# Altium schematic sheet motor0.SchDoc
size A4; SheetNumber: 2; SheetTotal: 4
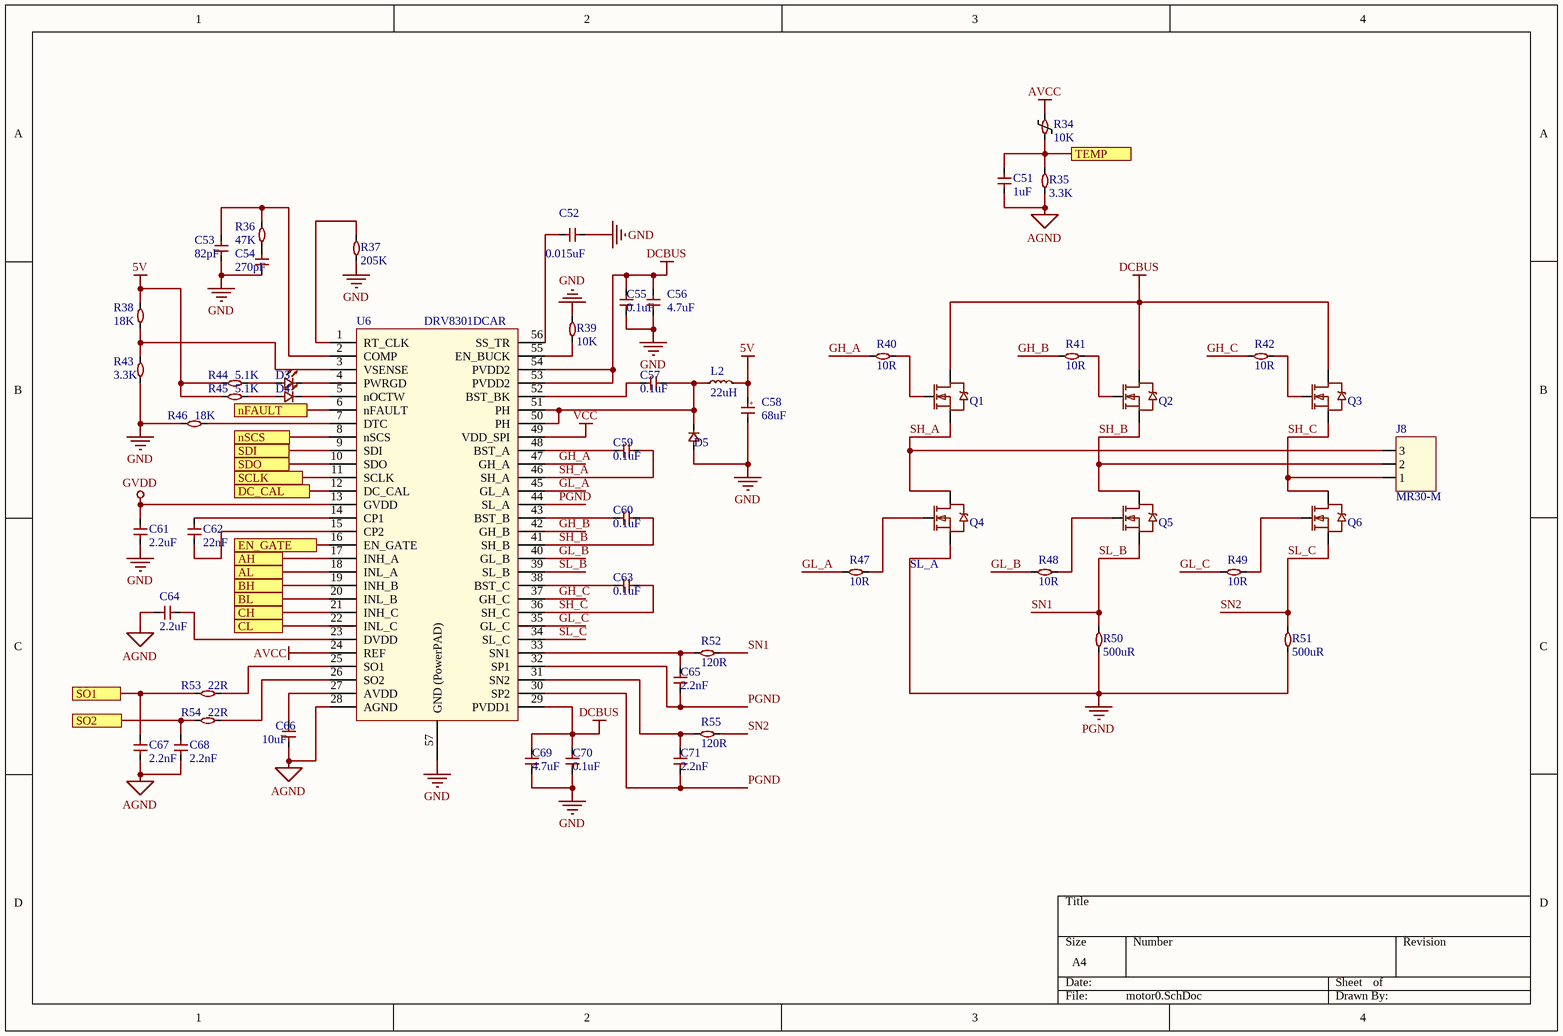
[diagram p0: motor0.SchDoc]

## Parts
C51  1uF  [C0402]
C52  0.015uF  [C0402]
C53  82pF  [C0402]
C54  270pF  [C0402]
C55  0.1uF  [C0402]
C56  4.7uF  [C0402]
C57  0.1uF  [C0402]
C58  68uF  [C1206]
C59  0.1uF  [C0402]
C60  0.1uF  [C0402]
C61  2.2uF  [C0402]
C62  22nF  [C0402]
C63  0.1uF  [C0402]
C64  2.2uF  [C0402]
C65  2.2nF  [C0402]
C66  10uF  [C0402]
C67  2.2nF  [C0402]
C68  2.2nF  [C0402]
C69  4.7uF  [C0402]
C70  0.1uF  [C0402]
C71  2.2nF  [C0402]
D3  LED  [LED-0402]  (value not drawn)
D4  LED  [LED-0402]  (value not drawn)
D5  MBR0540  [SOD-323]  (value not drawn)
J8  MR30-M  [AMASS-MR30-M]
L2  22uH  [L1008]
Q1  AP68N06G  [TDSON-8_L5.0-W6.0-3PIN]  (value not drawn)
Q2  AP68N06G  [TDSON-8_L5.0-W6.0-3PIN]  (value not drawn)
Q3  AP68N06G  [TDSON-8_L5.0-W6.0-3PIN]  (value not drawn)
Q4  AP68N06G  [TDSON-8_L5.0-W6.0-3PIN]  (value not drawn)
Q5  AP68N06G  [TDSON-8_L5.0-W6.0-3PIN]  (value not drawn)
Q6  AP68N06G  [TDSON-8_L5.0-W6.0-3PIN]  (value not drawn)
R34  10K  [R0402]
R35  3.3K  [R0402]
R36  47K  [R0402]
R37  205K  [R0402]
R38  18K  [R0402]
R39  10K  [R0402]
R40  10R  [R0402]
R41  10R  [R0402]
R42  10R  [R0402]
R43  3.3K  [R0402]
R44  5.1K  [R0402]
R45  5.1K  [R0402]
R46  18K  [R0402]
R47  10R  [R0402]
R48  10R  [R0402]
R49  10R  [R0402]
R50  500uR  [R2512]
R51  500uR  [R2512]
R52  120R  [R0402]
R53  22R  [R0402]
R54  22R  [R0402]
R55  120R  [R0402]
U6  DRV8301DCAR  [HTSSOP-56_L14.0-W6.0-P0.50]

## Ports
AH (see main[7A]), AL (see main[7A]), BH (see main[7A]), BL (see main[7A]), CH (see main[7A]), CL (see main[7A]), DC_CAL (see main[7A]), EN_GATE (see main[7A], motor1[1C]), nFAULT (see main[8A], motor1[1B]), nSCS (see main[7A]), SCLK (see main[7A], motor1[1B]), SDI (see main[7A], motor1[1B]), SDO (see main[7A], motor1[1B]), SO1 (see main[8A]), SO2 (see main[8A]), TEMP (see main[8A])

## Nets
5V: C58.1 L2.2 R38.2 R44.1 R45.1
AGND: C51.2 C64.1 C66.2 C67.2 C68.2 R35.1 U6.28(AGND)
AVCC: R34.2 U6.24(REF)
DCBUS: C55.1 C56.1 C69.1 C70.1 Q1.3(D) Q2.3(D) Q3.3(D) U6.29(PVDD1) U6.53(PVDD2) U6.54(PVDD2)
GND: C52.2 C53.1 C54.1 C55.2 C56.2 C58.2 C61.1 C69.2 C70.2 D5.2 R37.2 R39.2 R43.1 R46.1 U6.57(GND_(PowerPAD))
GVDD: C61.2 U6.13(GVDD)
PGND: C65.2 C71.2 Q4.2(S) R50.2 R51.2 U6.30(SP2) U6.32(SP1) U6.44(SL_A)
VCC: U6.49(VDD_SPI)
AH: U6.17(INH_A) ; port AH
AL: U6.18(INL_A) ; port AL
BH: U6.19(INH_B) ; port BH
BL: U6.20(INL_B) ; port BL
CH: U6.21(INH_C) ; port CH
CL: U6.22(INL_C) ; port CL
DC_CAL: U6.12(DC_CAL) ; port DC_CAL
EN_GATE: U6.16(EN_GATE) ; port EN_GATE
GH_A: R40.2 U6.47(GH_A)
GH_B: R41.2 U6.42(GH_B)
GH_C: R42.2 U6.37(GH_C)
GL_A: R47.2 U6.45(GL_A)
GL_B: R48.2 U6.40(GL_B)
GL_C: R49.2 U6.35(GL_C)
nFAULT: U6.6(nFAULT) ; port nFAULT
nSCS: U6.8(nSCS) ; port nSCS
SCLK: U6.11(SCLK) ; port SCLK
SDI: U6.9(SDI) ; port SDI
SDO: U6.10(SDO) ; port SDO
SH_A: C59.2 J8.3 Q1.2(S) Q4.3(D) U6.46(SH_A)
SH_B: C60.2 J8.2 Q2.2(S) Q5.3(D) U6.41(SH_B)
SH_C: C63.2 J8.1 Q3.2(S) Q6.3(D) U6.36(SH_C)
SL_B: Q5.2(S) R50.1 R52.2 U6.39(SL_B)  [also labelled SN1]
SL_C: Q6.2(S) R51.1 R55.2 U6.34(SL_C)  [also labelled SN2]
SO1: C67.1 R53.1 ; port SO1
SO2: C68.1 R54.1 ; port SO2
TEMP: C51.1 R34.1 R35.2 ; port TEMP
NetC52_1: C52.1 U6.56(SS_TR)
NetC53_2: C53.2 R36.1 U6.2(COMP)
NetC54_2: C54.2 R36.2
NetC57_1: C57.1 U6.52(BST_BK)
NetC57_2: C57.2 D5.1 L2.1 U6.50(PH) U6.51(PH)
NetC59_1: C59.1 U6.48(BST_A)
NetC60_1: C60.1 U6.43(BST_B)
NetC62_1: C62.1 U6.15(CP2)
NetC62_2: C62.2 U6.14(CP1)
NetC63_1: C63.1 U6.38(BST_C)
NetC64_2: C64.2 U6.23(DVDD)
NetC65_1: C65.1 R52.1 U6.33(SN1)
NetC66_1: C66.1 U6.27(AVDD)
NetC71_1: C71.1 R55.1 U6.31(SN2)
NetD3_1: D3.1 U6.4(PWRGD)
NetD3_2: D3.2 R44.2
NetD4_1: D4.1 U6.5(nOCTW)
NetD4_2: D4.2 R45.2
NetQ1_1: Q1.1(G) R40.1
NetQ2_1: Q2.1(G) R41.1
NetQ3_1: Q3.1(G) R42.1
NetQ4_1: Q4.1(G) R47.1
NetQ5_1: Q5.1(G) R48.1
NetQ6_1: Q6.1(G) R49.1
NetR37_1: R37.1 U6.1(RT_CLK)
NetR38_1: R38.1 R43.2 U6.3(VSENSE)
NetR39_1: R39.1 U6.55(EN_BUCK)
NetR46_2: R46.2 U6.7(DTC)
NetR53_2: R53.2 U6.25(SO1)
NetR54_2: R54.2 U6.26(SO2)

## Notes on the sheet
- (near Q4) SL_A
- (in symbol CAP+) +

## Library data of the parts
C51-C57 C59-C71 = CAP: 贴片电容; Manufacturer: SAMSUNG(三星); Manufacturer Part: CL05A105KP5NNND; Add into BOM: yes; Tolerance: ±10%; Voltage Rated: 10V; Temperature Coefficient: X5R; Symbol: CAP-0402; Device: cap-0402; LCSC Part Name: 1uF ±10% 10V; Supplier Part: C307414; Supplier Footprint: 0402; JLCPCB Part Class: Extended Part; Datasheet: https://atta.szlcsc.com/upload/public/pdf/source/20181009/C307414_0A02B57115E94FED95F0CB1E32115BFC.pdf; Supplier: LCSC; Convert to PCB: yes
C58 = CAP+: 贴片型铝电解电容，50V; Manufacturer: SAMSUNG(三星); Manufacturer Part: CL05A105KP5NNND; Add into BOM: yes; Tolerance: ±10%; Voltage Rated: 10V; Temperature Coefficient: X5R; Symbol: CAP-0402; Device: cap-0402; LCSC Part Name: 1uF ±10% 10V; Supplier Part: C307414; Supplier Footprint: 0402; JLCPCB Part Class: Extended Part; Datasheet: https://atta.szlcsc.com/upload/public/pdf/source/20181009/C307414_0A02B57115E94FED95F0CB1E32115BFC.pdf; Supplier: LCSC; Convert to PCB: yes
D3 D4 = LED: 贴片发光二极管; Manufacturer: SAMSUNG(三星); Manufacturer Part: CL05A105KP5NNND; Add into BOM: yes; Tolerance: ±10%; Voltage Rated: 10V; Temperature Coefficient: X5R; Symbol: CAP-0402; Device: cap-0402; LCSC Part Name: 1uF ±10% 10V; Supplier Part: C307414; Supplier Footprint: 0402; JLCPCB Part Class: Extended Part; Datasheet: https://atta.szlcsc.com/upload/public/pdf/source/20181009/C307414_0A02B57115E94FED95F0CB1E32115BFC.pdf; Supplier: LCSC; Convert to PCB: yes
D5 = DIO: 肖特基二极管; Manufacturer: SAMSUNG(三星); Manufacturer Part: CL05A105KP5NNND; Add into BOM: yes; Tolerance: ±10%; Voltage Rated: 10V; Temperature Coefficient: X5R; Symbol: CAP-0402; Device: cap-0402; LCSC Part Name: 1uF ±10% 10V; Supplier Part: C307414; Supplier Footprint: 0402; JLCPCB Part Class: Extended Part; Datasheet: https://atta.szlcsc.com/upload/public/pdf/source/20181009/C307414_0A02B57115E94FED95F0CB1E32115BFC.pdf; Supplier: LCSC; Convert to PCB: yes
J8 = HC-3P-1.0mm: 线对板连接器
L2 = IND: 贴片电感
Q1-Q6 = NMOS: N沟道功率mos管; Manufacturer: BORN(伯恩半导体); Name: AO3401A; Symbol: AO3401A_C306862; Add into BOM: yes; Type: P沟道; Drain Source Voltage (Vdss): 30V; Continuous Drain Current (Id): 4.2A; Power Dissipation (Pd): 1.4W; Drain Source On Resistance (RDS(on)@Vgs,Id): 50mΩ@10V,4.1A; Gate Threshold Voltage (Vgs(th)@Id): 2V@250uA; Device: AO3401A_C306862; LCSC Part Name: P沟道 30V 4.2A; Supplier Part: C306862; Manufacturer Part: AO3401A; Supplier Footprint: SOT-23; JLCPCB Part Class: 扩展库; Datasheet: https://atta.szlcsc.com/upload/public/pdf/source/20190514/C306862_F7EF2FFF49BA48EA0D342955B5285B33.pdf; Supplier: LCSC; Convert to PCB: yes
R34 = NTC: 热敏电阻; Manufacturer: UNI-ROYAL(厚声); Manufacturer Part: 0402WGF1001TCE; Add into BOM: yes; Tolerance: ±1%; Power(Watts): 1/16W; Temperature Coefficient: ±100ppm/; Overload Voltage (Max): 50V; Symbol: RES-0402; Device: res-0402; LCSC Part Name: 1k ±1%; Supplier Part: C11702; Supplier Footprint: 0402; Datasheet: https://atta.szlcsc.com/upload/public/pdf/source/20200306/C422600_1E6D84923E4A46A82E41ADD87F860B5C.pdf; Supplier: LCSC; Convert to PCB: yes; Type: 厚膜电阻; Operating Temperature Range: -55~+155; JLCPCB Part Class: 基础库
R35-R49 R52-R55 = RES: 贴片电阻; Manufacturer: UNI-ROYAL(厚声); Manufacturer Part: 0402WGF1001TCE; Add into BOM: yes; Tolerance: ±1%; Power(Watts): 1/16W; Temperature Coefficient: ±100ppm/; Overload Voltage (Max): 50V; Symbol: RES-0402; Device: res-0402; LCSC Part Name: 1k ±1%; Supplier Part: C11702; Supplier Footprint: 0402; Datasheet: https://atta.szlcsc.com/upload/public/pdf/source/20200306/C422600_1E6D84923E4A46A82E41ADD87F860B5C.pdf; Supplier: LCSC; Convert to PCB: yes; Type: 厚膜电阻; Operating Temperature Range: -55~+155; JLCPCB Part Class: 基础库
R50 = RES: 贴片电阻 2512; Manufacturer: UNI-ROYAL(厚声); Manufacturer Part: 0402WGF1001TCE; Add into BOM: yes; Tolerance: ±1%; Power(Watts): 1/16W; Temperature Coefficient: ±100ppm/; Overload Voltage (Max): 50V; Symbol: RES-0402; Device: res-0402; LCSC Part Name: 1k ±1%; Supplier Part: C11702; Supplier Footprint: 0402; Datasheet: https://atta.szlcsc.com/upload/public/pdf/source/20200306/C422600_1E6D84923E4A46A82E41ADD87F860B5C.pdf; Supplier: LCSC; Convert to PCB: yes; Type: 厚膜电阻; Operating Temperature Range: -55~+155; JLCPCB Part Class: 基础库
R51 = RES: 贴片电阻 / 2512; Manufacturer: UNI-ROYAL(厚声); Manufacturer Part: 0402WGF1001TCE; Add into BOM: yes; Tolerance: ±1%; Power(Watts): 1/16W; Temperature Coefficient: ±100ppm/; Overload Voltage (Max): 50V; Symbol: RES-0402; Device: res-0402; LCSC Part Name: 1k ±1%; Supplier Part: C11702; Supplier Footprint: 0402; Datasheet: https://atta.szlcsc.com/upload/public/pdf/source/20200306/C422600_1E6D84923E4A46A82E41ADD87F860B5C.pdf; Supplier: LCSC; Convert to PCB: yes; Type: 厚膜电阻; Operating Temperature Range: -55~+155; JLCPCB Part Class: 基础库
U6 = DRV8301DCAR: 三相电机/栅极驱动IC